# Altium schematic sheet [14]-MAIN_CONNECTORS.SchDoc
size A4
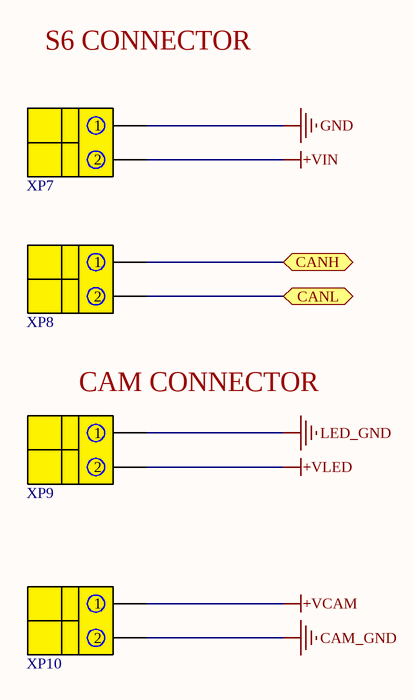
[diagram p0: [14]-MAIN_CONNECTORS.SchDoc]

## Parts
XP7  DG330-2P  [DG330-2P]  (value not drawn)
XP8  DG330-2P  [DG330-2P]  (value not drawn)
XP9  DG330-2P  [DG330-2P]  (value not drawn)
XP10  DG330-2P  [DG330-2P]  (value not drawn)

## Ports
CANH (bidir), CANL (bidir)

## Nets
+VCAM: XP10.1
+VIN: XP7.2
+VLED: XP9.2
CAM_GND: XP10.2
GND: XP7.1
LED_GND: XP9.1
CANH: XP8.1 ; port CANH
CANL: XP8.2 ; port CANL

## Notes on the sheet
- (near XP7) S6 CONNECTOR
- (near XP9) CAM CONNECTOR

## Library data of the parts
XP7-XP10 = DG330-2P: Degson 2 pin connector rear; Value: DG330-2P